# Altium schematic sheet ESenseFE-Power.SchDoc
size B
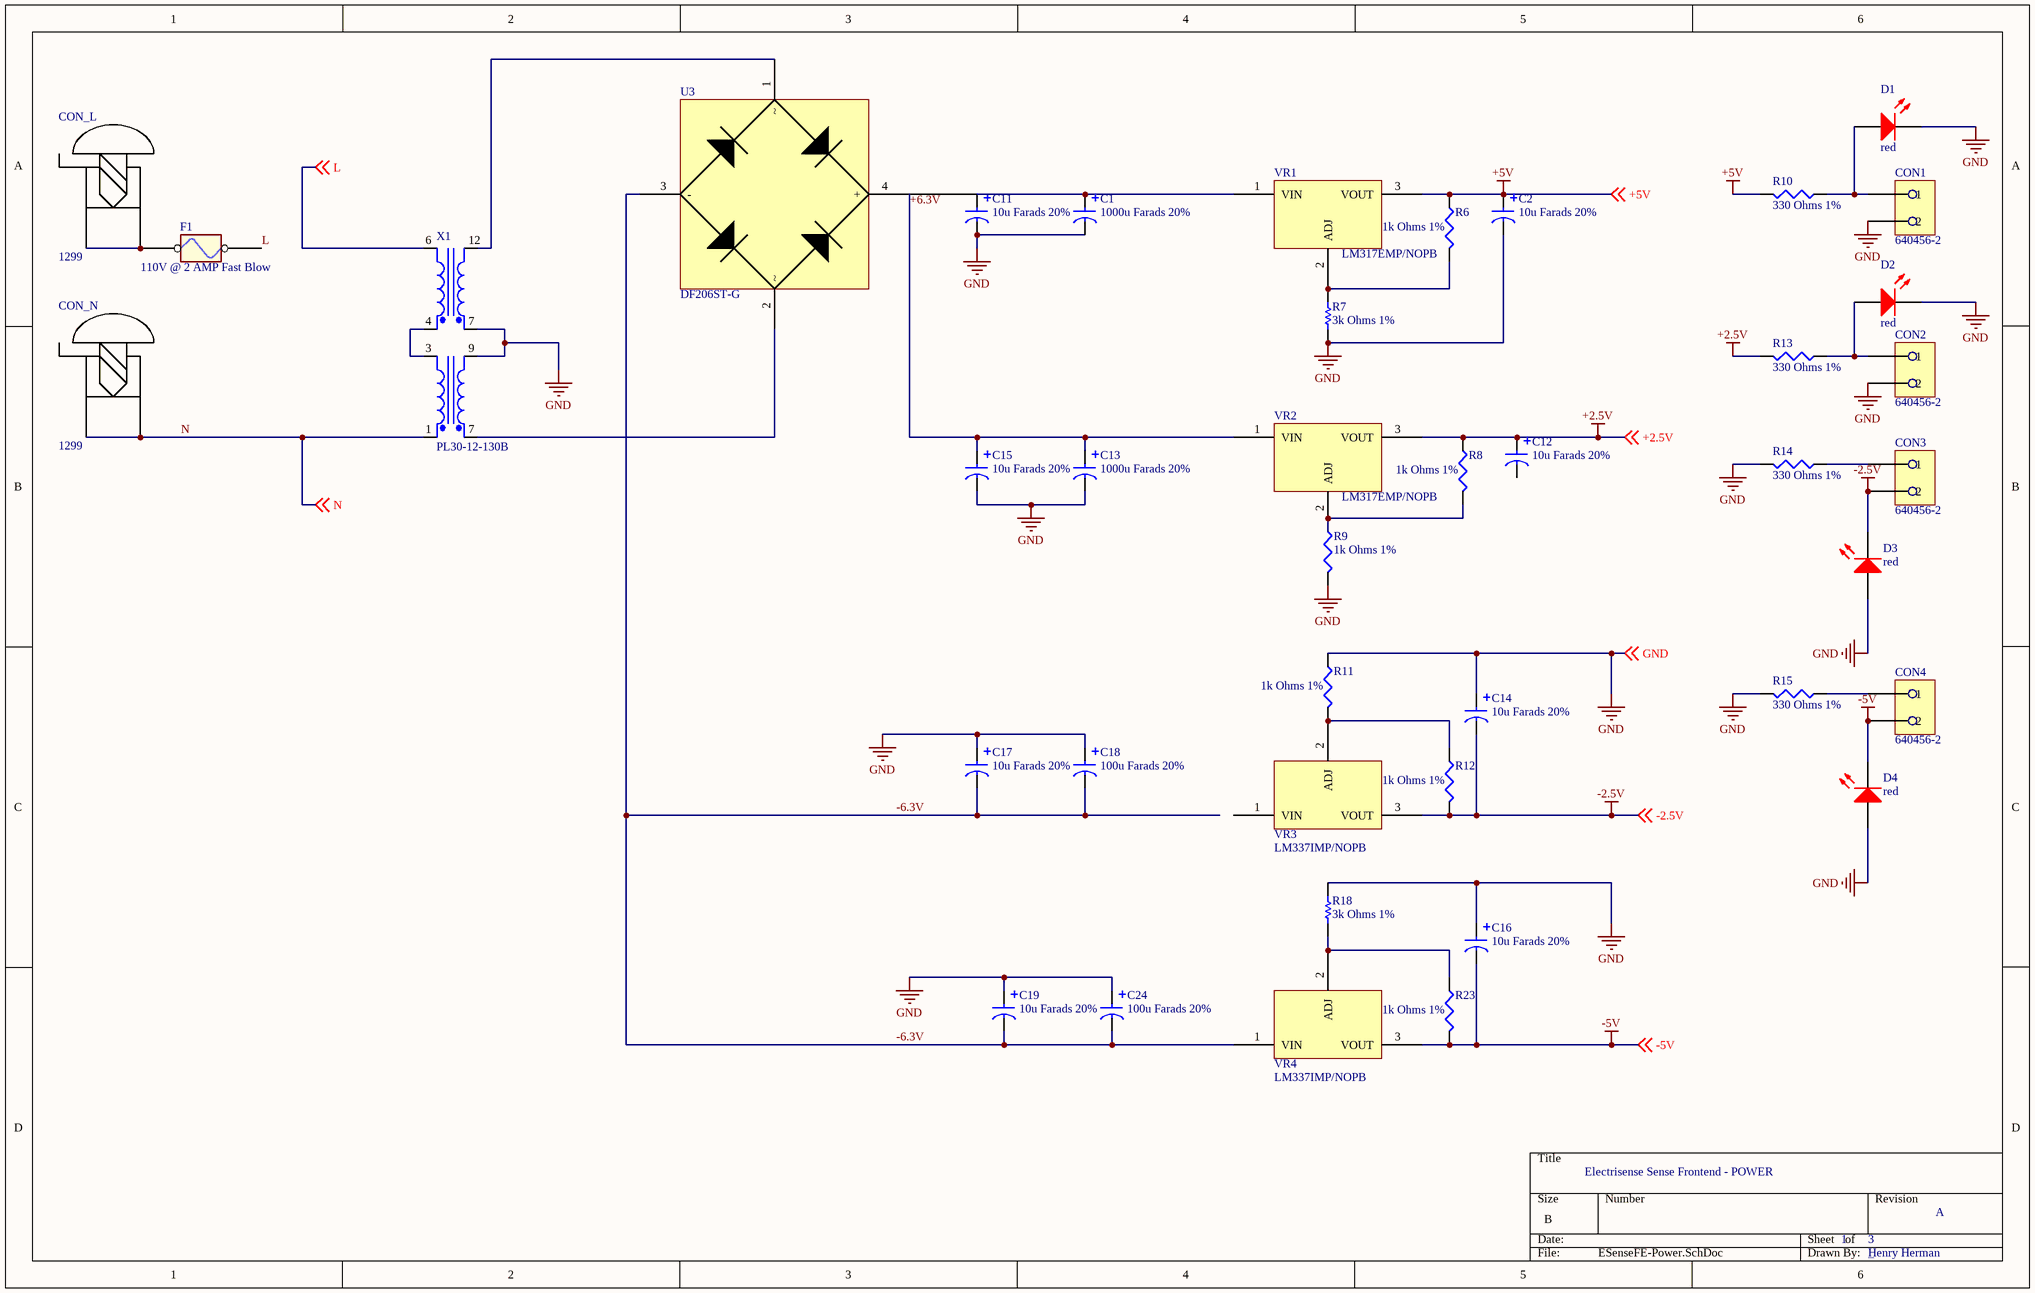
[diagram p0: ESenseFE-Power.SchDoc]

## Parts
C1  1000u Farads 20%  [CAP-CAN-SMD-POL-12.5mmDia]
C2  10u Farads 20%  [CAP-SMD-POL-5mmDia]
C11  10u Farads 20%  [CAP-SMD-POL-5mmDia]
C12  10u Farads 20%  [CAP-SMD-POL-5mmDia]
C13  1000u Farads 20%  [CAP-CAN-SMD-POL-12.5mmDia]
C14  10u Farads 20%  [CAP-SMD-POL-5mmDia]
C15  10u Farads 20%  [CAP-SMD-POL-5mmDia]
C16  10u Farads 20%  [CAP-SMD-POL-5mmDia]
C17  10u Farads 20%  [CAP-SMD-POL-5mmDia]
C18  100u Farads 20%  [CAP-SMD-POL-5mmDia]
C19  10u Farads 20%  [CAP-SMD-POL-5mmDia]
C24  100u Farads 20%  [CAP-SMD-POL-5mmDia]
CON1  640456-2  [M02-LockingHeader-100mil-pitch]
CON2  640456-2  [M02-LockingHeader-100mil-pitch]
CON3  640456-2  [M02-LockingHeader-100mil-pitch]
CON4  640456-2  [M02-LockingHeader-100mil-pitch]
CON_L  1299  [LOW-PROFILE-SCREWTERMINAL]
CON_N  1299  [LOW-PROFILE-SCREWTERMINAL]
D1  red  [LITEON/LED/0603]
D2  red  [LITEON/LED/0603]
D3  red  [LITEON/LED/0603]
D4  red  [LITEON/LED/0603]
F1  110V @ 2 AMP Fast Blow  [WICKMANN/WK0011-ND]
R6  1k Ohms 1%  [SM/C_0603]
R7  3k Ohms 1%  [SM/C_0603]
R8  1k Ohms 1%  [SM/C_0603]
R9  1k Ohms 1%  [SM/C_0603]
R10  330 Ohms 1%  [SM/C_0603]
R11  1k Ohms 1%  [SM/C_0603]
R12  1k Ohms 1%  [SM/C_0603]
R13  330 Ohms 1%  [SM/C_0603]
R14  330 Ohms 1%  [SM/C_0603]
R15  330 Ohms 1%  [SM/C_0603]
R18  3k Ohms 1%  [SM/C_0603]
R23  1k Ohms 1%  [SM/C_0603]
U3  DF206ST-G  [BridgeRectifier-DFS]
VR1  LM317EMP/NOPB  [LM317-SOT233-POS-ADJ-VOLT_REG]
VR2  LM317EMP/NOPB  [LM317-SOT233-POS-ADJ-VOLT_REG]
VR3  LM337IMP/NOPB  [LM337-ADJ-NEG-VOLT-REG]
VR4  LM337IMP/NOPB  [LM337-ADJ-NEG-VOLT-REG]
X1  PL30-12-130B  [TRANSFORMER-DUAL-PRIMARY]

## Nets
+2.5V: C12.1 R8.1 R13.2 VR2.3(VOUT) ; off-sheet +2.5V
+5V: C2.1 R6.1 R10.2 VR1.3(VOUT) ; off-sheet +5V
-2.5V: C14.2 CON3.2 D3.2(K) R12.2 VR3.3(VOUT) ; off-sheet -2.5V
-5V: C16.2 CON4.2 D4.2(K) R23.2 VR4.3(VOUT) ; off-sheet -5V
GND: C1.2 C2.2 C11.2 C13.2 C14.1 C15.2 C16.1 C17.1 C18.1 C19.1 C24.1 CON1.2 CON2.2 D1.2(K) D2.2(K) D3.1(A) D4.1(A) R7.1 R9.2 R11.1 R14.2 R15.2 R18.2 X1.7 X1.9 ; off-sheet GND
+6.3V: C13.1 C15.1 U3.4(+) VR2.1(VIN)
-6.3V: C17.2 C18.2 C19.2 C24.2 U3.3(-) VR4.1(VIN)
L: F1.2 X1.6(Pri-) ; off-sheet L
N: CON_N.1 X1.1(Pri+) ; off-sheet N
NetC1_1: C1.1 C11.1 VR1.1(VIN)
NetCON1_1: CON1.1 D1.1(A) R10.1
NetCON2_1: CON2.1 D2.1(A) R13.1
NetCON3_1: CON3.1 R14.1
NetCON4_1: CON4.1 R15.1
NetCON_L_1: CON_L.1 F1.1
NetR6_2: R6.2 R7.2 VR1.2(ADJ)
NetR8_2: R8.2 R9.1 VR2.2(ADJ)
NetR11_2: R11.2 R12.1 VR3.2(ADJ)
NetR18_1: R18.1 R23.1 VR4.2(ADJ)
NetU3_1: U3.1 X1.12(Sec-)
NetU3_2: U3.2 X1.7(Sec+)
NetX1_3: X1.3(Pri-) X1.4(Pri+)

Not connected (* = marked no-connect by the designer): C12 2; VR3 1(VIN)

## Notes on the sheet
- Electrisense Sense Frontend - POWER
- 1
- 3
- A
- _
- Henry Herman

## Library data of the parts
C1 C13 = 2198: cap aluminum 1000uf 25vdc 20% 12.5 x 13.5mm smd 1100ma 5000; mfrName: Panasonic; mfrPartNum: EEV-FK1E102Q; Label: 1uF; Extra_Description: CAP 1000UF 25V ELECT FK SMD / Mounting Type: ``Surface Mount`` / Lead-Free Status: ``Lead Free`` / Packaging: ``Cut Tape (CT)`` / RoHS: ``Compliant`` / Voltage Rating (DC): { / ``uncertainty_minus``: null, / ``value``: 25.0, / ``uncertainty_plus``: null / } / Size-Width: { / ``uncertainty_minus``: null, / ``value``: 0.0135, / ``uncertainty_plus``: null / } / Size-Length: { / ``uncertainty_minus``: null, / ``value``: 0.015, / ``uncertainty_plus``: null / } / Size-Height: { / ``uncertainty_minus``: null, / ``value``: 0.0135, / ``uncertainty_plus``: null / } / Size-Diameter: { / ``uncertainty_minus``: null, / ``value``: 0.0125, / ``uncertainty_plus``: null / } / Capacitance: { / ``uncertainty_minus``: null, / ``value``: 0.001, / ``uncertainty_plus``: null / } / Capacitance Tolerance: { / ``max_value``: 20.0, / ``max_uncertainty_plus``: null, / ``min_value``: -20.0, / ``min_uncertainty_plus``: null, / ``max_uncertainty_minus``: null / } / Operating Temperature: { / ``max_value``: 105.0, / ``max_uncertainty_plus``: null, / ``min_value``: null, / ``min_uncertainty_plus``: null, / ``max_uncertainty_minus``: null / }; Obsolete: False; Temp_Max: 0; Type: All Parts; TypeNotes: Applies to all parts in the database; PartID: 2198; URL_Image: http://cdn.sigma.octopart.com/8933382/image/Panasonic-EEV-FK1E102Q.jpg; URL_Datasheet: http://datasheet.octopart.com/EEV-FK1E102Q-Panasonic-datasheet-48.pdf; Date_Created: 5/7/2011 2:26:18 AM; Date_LastModified: 5/7/2011 2:26:18 AM; Verified: False; RoHS: True; Temp_Min: 0
C2 C11 C12 C14-C17 C19 = 2178: capacitor, case c, 10uf, 25v; application:general purpose;; mfrName: Panasonic; mfrPartNum: EEE1EA100SR; Label: 1uF; Extra_Description: CAPACITOR, CASE C, 10UF, 25V; Application:General Purpose; Capacitance:10µF; Tolerance, Capacitance:± 20%; Series:VS; Voltage, Rating:25V dc; Capacitor Dielectric Type:Aluminium Electrolytic; Case Style:C; External Length / Height:5.4mm; Body Diameter:5mm; Lead Spacing:1.5mm; Termination Type:SMD; Operating Temperature Range:-40°C to +85°C; AC Ripple Current:28mA; External Depth:5.3mm; Lead Length:2.2mm; Leakage Current:3µA; Operating Lifetime:2000h; Power Factor:0.14; Power Factor Frequency:120Hz; Ripple Current Frequency:120Hz; Temp, Op. Max:85°C; Temp, Op. Min:-40°C; Temperature, Operating Life:85°C; Temperature, Ripple Current:85°C; Tolerance, +:20%; Tolerance, -:20%; Voltage Rating, DC:25V; Width, External:5.3mm; Width, Lead Cross-section:0.65mm; Width, Tape:12mm / Mounting Type: ``Surface Mount`` / Lead-Free Status: ``Lead Free`` / Packaging: ``Cut Tape (CT)`` / Dielectric Material: ``Aluminum Electrolytic`` / RoHS: ``Compliant`` / Size-Height: { / ``uncertainty_minus``: null, / ``value``: 0.0054, / ``uncertainty_plus``: null / } / Voltage Rating (DC): { / ``uncertainty_minus``: null, / ``value``: 25.0, / ``uncertainty_plus``: null / } / Lead Length: { / ``uncertainty_minus``: null, / ``value``: 0.0022, / ``uncertainty_plus``: null / } / Size-Diameter: { / ``uncertainty_minus``: null, / ``value``: 0.005, / ``uncertainty_plus``: null / } / Capacitance: { / ``uncertainty_minus``: null, / ``value``: 1E-05, / ``uncertainty_plus``: null / } / Capacitance Tolerance: { / ``max_value``: 20.0, / ``max_uncertainty_plus``: null, / ``min_value``: -20.0, / ``min_uncertainty_plus``: null, / ``max_uncertainty_minus``: null / } / Operating Temperature: { / ``max_value``: 85.0, / ``max_uncertainty_plus``: null, / ``min_value``: null, / ``min_uncertainty_plus``: null, / ``max_uncertainty_minus``: null / } / Number of Pins: 2; Obsolete: False; Temp_Max: 0; Type: All Parts; TypeNotes: Applies to all parts in the database; PartID: 2178; URL_Image: http://cdn.sigma.octopart.com/8896371/image/Panasonic-EEE1EA100SR.jpg; URL_Datasheet: http://datasheet.octopart.com/EEE1EA100SR-Panasonic-datasheet-5314063.pdf; Date_Created: 5/5/2011 2:23:52 AM; Date_LastModified: 5/5/2011 2:23:52 AM; Verified: False; RoHS: True; Temp_Min: 0
C18 C24 = 2180: cap 100uf 25vdc 20% 6.3 x 7.7mm smd 143ma 2000 hr t/r; mfrName: Panasonic; mfrPartNum: EEE-1EA101XP; Label: 1uF; Extra_Description: CAP ELECT 100UF 25V VS SMD / Mounting Type: ``Surface Mount`` / Lead-Free Status: ``Lead Free`` / Packaging: ``Cut Tape (CT)`` / RoHS: ``Compliant`` / Size-Height: { / ``uncertainty_minus``: null, / ``value``: 0.008, / ``uncertainty_plus``: null / } / Voltage Rating (DC): { / ``uncertainty_minus``: null, / ``value``: 25.0, / ``uncertainty_plus``: null / } / Size-Diameter: { / ``uncertainty_minus``: null, / ``value``: 0.0063, / ``uncertainty_plus``: null / } / Capacitance: { / ``uncertainty_minus``: null, / ``value``: 0.0001, / ``uncertainty_plus``: null / } / Capacitance Tolerance: { / ``max_value``: 20.0, / ``max_uncertainty_plus``: null, / ``min_value``: -20.0, / ``min_uncertainty_plus``: null, / ``max_uncertainty_minus``: null / } / Operating Temperature: { / ``max_value``: 85.0, / ``max_uncertainty_plus``: null, / ``min_value``: null, / ``min_uncertainty_plus``: null, / ``max_uncertainty_minus``: null / }; Obsolete: False; Temp_Max: 0; Type: All Parts; TypeNotes: Applies to all parts in the database; PartID: 2180; URL_Image: http://cdn.sigma.octopart.com/9093796/image/Panasonic-EEE-1EA101XP.jpg; URL_Datasheet: http://datasheet.octopart.com/EEE-1EA101XP-Panasonic-datasheet-6019.pdf; Date_Created: 5/5/2011 3:27:05 AM; Date_LastModified: 5/5/2011 3:27:05 AM; Verified: False; RoHS: True; Temp_Min: 0
CON1-CON4 = 2184: header, vertical, 0.1``, 2way; connector type:wire-to-board;; mfrName: Tyco Electronics; Extra_Description: HEADER, VERTICAL, 0.1``, 2WAY; Connector Type:Wire-to-Board; Gender:Pin; Ways, No. of:2; Lead Spacing:2.54mm; Termination Method:Solder; Contact Material:Copper Alloy; Series:MTA; Contact Plating:Tin; No. of Rows:1; Current Rating:4A; No. of Poles:2; Pitch:0.1``; Voltage Rating, AC:250V; Voltage, Working:250V / Contact Plating: ``Tin`` / Gender: ``Male`` / Packaging: ``Bulk`` / RoHS: ``Compliant`` / Mounting Type: ``Through Hole`` / Lead-Free Status: ``Lead Free`` / Contact Material: ``Copper Alloy`` / Shrouded: ``No`` / Housing Color: ``White`` / Housing Material: ``Polyester`` / Current Rating: { / ``uncertainty_minus``: null, / ``value``: 4.0, / ``uncertainty_plus``: null / } / Pin Pitch: { / ``uncertainty_minus``: null, / ``value``: 0.00254, / ``uncertainty_plus``: null / } / Size-Width: { / ``uncertainty_minus``: null, / ``value``: 0.005715, / ``uncertainty_plus``: null / } / Size-Length: { / ``uncertainty_minus``: null, / ``value``: 0.00508, / ``uncertainty_plus``: null / } / Size-Height: { / ``uncertainty_minus``: null, / ``value``: 0.007874, / ``uncertainty_plus``: null / } / Mounting Angle: { / ``uncertainty_minus``: null, / ``value``: 180.0, / ``uncertainty_plus``: null / } / Voltage Rating (AC): { / ``uncertainty_minus``: null, / ``value``: 250.0, / ``uncertainty_plus``: null / } / Operating Temperature: { / ``max_value``: 105.0, / ``max_uncertainty_plus``: null, / ``min_value``: null, / ``min_uncertainty_plus``: null, / ``max_uncertainty_minus``: null / } / Number of Contacts: 2 / Number of Positions: 2 / Number of Rows: 1; Obsolete: False; Temp_Max: 0; TypeNotes: Applies to all parts in the database; PartID: 2184; mfrPartNum: 640456-2; URL_Image: http://cdn.sigma.octopart.com/9084900/image/Tyco-Electronics-640456-2.jpg; URL_Datasheet: http://datasheet.octopart.com/640456-2-Tyco-Electronics-datasheet-21919.pdf; Date_Created: 5/5/2011 5:31:56 AM; Date_LastModified: 5/5/2011 5:31:56 AM; Verified: False; RoHS: True; Temp_Min: 0; Type: All Parts
CON_L CON_N = 2177: brass tin plate low profile 10 - 32 thread with anti; mfrName: Keystone; Extra_Description: Brass Tin Plate Low Profile 10 - 32 Thread with Anti Rotation Tab Screw Terminal / Termination Style: ``Crimp`` / Material: ``Brass`` / Packaging: ``Bulk`` / Orientation: ``Straight`` / RoHS: ``Compliant`` / Lead-Free Status: ``Lead Free`` / Color: ``Black``; Obsolete: False; Temp_Max: 0; TypeNotes: Applies to all parts in the database; PartID: 2177; mfrPartNum: 1299; mfrWebsite: http://www.keyelco.com/; URL_Image: http://cdn.sigma.octopart.com/8947666/image/Keystone-1299.jpg; URL_Datasheet: http://datasheet.octopart.com/1299-Keystone-datasheet-23631.pdf; Date_Created: 5/5/2011 1:44:10 AM; Date_LastModified: 5/5/2011 1:44:10 AM; Verified: False; RoHS: True; Temp_Min: 0; Type: All Parts
D1-D4 = 2002: LED SUPER RED CLEAR 0603 SMD; mfrName: LITE-ON INC; mfrPartNum: LTST-C190KRKT; Extra_Description: Datasheets	LTST-C190KRKT / Product Photos	LTST-C190KGKT, LTST-C190KGKT, LTST-C190KSKT, LTST-C190KYKT / Catalog Drawings	LED 0603 Series / LED 0603 Series Side / Standard Package	1 / Category	Optoelectronics / Family	LEDs - <75mA, Discrete / Series	- / Color	Red / Luminous Flux @ Current - Test	196 mlm / Current - Test	20mA / Wavelength - Dominant	631nm / Wavelength - Peak	639nm / Millicandela Rating	54mcd / Voltage - Forward (Vf) Typ	2.0V / Lens Type	Clear / Lens Style/Size	Rectangle, 1.06mm x 0.8mm / Package / Case	0603 (1608 Metric) / Mounting Type	Surface Mount / Viewing Angle	130° / Packaging	Cut Tape (CT) / Size / Dimension	* / Height	* / Catalog Page	2744 (US2010 Interactive) / 2744 (US2010 PDF) / Other Names	160-1436-1; Obsolete: False; Temp_Max: 0; Type: UNKNOWN; Published: 8-Jun-2000; LatestRevisionDate: 17-Jul-2002; LatestRevisionNote: Re-released for DXP Platform.; PackageVersion: Feb-2002; PackageReference: 3.2X1.6X1.1; Publisher: Altium Limited; PartID: 2002; URL_Image: http://media.digikey.com/photos/Lite%20On%20Photos/LTST-C190KGKT,LTST-C190KRKT,LTST-C190KSKT,LTST-C190KYKT_sml.jpg; URL_Datasheet: http://optoelectronics.liteon.com/en-us/api/DwonloadFileHandler.ashx?txtSpecNo=DS-22-99-0151&txtPartNo=LTST-C190KRKT; Date_Created: 7/8/2010 11:36:30 PM; Date_LastModified: 7/8/2010 11:36:30 PM; Verified: False; RoHS: True; Temp_Min: 0
F1 = 1045: FUSEHOLDER OPEN 5X20MM PC MNT; mfrName: Wickmann USA, Inc.; mfrPartNum: 6490000100; Extra_Description: Wickmann USA, Inc. / TypeHolder / Fuse Size5mm x 20mm / MountingPCB / SpecificationsMiniature / MaterialThermoplastic, Black / Other Names19649 / 649 / WK0011; Type: Fuseholders; PartID: 1045; URL_Image: http://media.digikey.com/photos/Wickmann%20Photos/6490000100_sml.jpg; URL_Datasheet: http://www.digikey.com/scripts/DkSearch/dksus.dll?Pname?Name=WK0011-ND&Site=US; Date_Created: 8/1/2004 3:23:57 AM; Date_LastModified: 8/21/2009 1:12:53 AM; Verified: False
R6 R8 R9 R11 R12 R23 = 2043: RES 1.00K OHM 1/10W 1% 0603 SMD; mfrName: Panasonic - ECG; mfrPartNum: ERJ-3EKF1001V; Extra_Description: Datasheets	ERJ-3EKF1001V View All Specifications / Product Photos	0603 Pkg / Catalog Drawings	1% Thick Film Chip Material / 1% Thick Film Chip / Standard Package	200 / Category	Resistors / Family	Chip Resistor - Surface Mount / Series	ERJ / Resistance In Ohms	1.00K / Power (Watts)	0.1W, 1/10W / Composition	Thick Film / Features	- / Temperature Coefficient	±100ppm/°C / Tolerance	±1% / Case	0603 (1608 metric) / Size / Dimension	0.063`` L x 0.031`` W (1.60mm x 0.80mm) / Height	0.018`` (0.45mm) / Lead Style	Surface Mount (SMD - SMT) / Packaging	Cut Tape (CT) / Catalog Page	1954 (US2010 Interactive) / 1954 (US2010 PDF) / Kits	RSM3H-ND - KIT CHIP RES 96 VALUES 50EA 0603 / Other Names	ERJ-3EKF1001 / ERJ3EKF1001 / P1.00KHCT; Obsolete: False; Temp_Max: 0; PartID: 2043; URL_Image: http://media.digikey.com/photos/Panasonic%20Photos/10-0603%20Resistor.jpg?cshift_ck=null&client_id=5042; URL_Datasheet: http://industrial.panasonic.com/www-cgi/jvcr13pz.cgi?E+PZ+3+AOA0002+ERJ3EKF1001V+7+WW; Date_Created: 9/14/2010 11:34:31 AM; Date_LastModified: 9/14/2010 11:34:31 AM; Verified: False; RoHS: True; Temp_Min: 0; Type: Chip Resistor - Surface Mount
R7 R18 = 2182: resistor, thick film, 30kohm, 100mw, 1%; resistance:30kohm;; mfrName: Yageo; mfrPartNum: RC0603FR-0730KL; Value: 1K; Extra_Description: RESISTOR, THICK FILM, 30KOHM, 100mW, 1%; Resistance:30kohm; Resistance Tolerance:± 1%; Power Rating:100mW; Voltage Rating:50V; Series:RC0603; Temperature Coefficient:± 100ppm/°C; Resistor Element Material:Thick Film ;RoHS Compliant: Yes / Mounting Type: ``Surface Mount`` / Case / Package: ``0603`` / Packaging: ``Cut Tape (CT)`` / Lead-Free Status: ``Lead Free`` / RoHS: ``Compliant`` / Resistance: { / ``uncertainty_minus``: null, / ``value``: 30000.0, / ``uncertainty_plus``: null / } / Voltage Rating (DC): { / ``uncertainty_minus``: null, / ``value``: 50.0, / ``uncertainty_plus``: null / } / Size-Width: { / ``uncertainty_minus``: null, / ``value``: 0.0008, / ``uncertainty_plus``: null / } / Size-Length: { / ``uncertainty_minus``: null, / ``value``: 0.0016, / ``uncertainty_plus``: null / } / Size-Height: { / ``uncertainty_minus``: null, / ``value``: 0.00045, / ``uncertainty_plus``: null / } / Power Rating: { / ``uncertainty_minus``: null, / ``value``: 0.1, / ``uncertainty_plus``: null / } / Resistance Tolerance: { / ``max_value``: 1.0, / ``max_uncertainty_plus``: null, / ``min_value``: -1.0, / ``min_uncertainty_plus``: null, / ``max_uncertainty_minus``: null / } / Operating Temperature: { / ``max_value``: 155.0, / ``max_uncertainty_plus``: null, / ``min_value``: null, / ``min_uncertainty_plus``: null, / ``max_uncertainty_minus``: null / }; Obsolete: False; Temp_Max: 0; TypeNotes: Applies to all parts in the database; Published: 8-Jun-2000; LatestRevisionDate: 17-Jul-2002; LatestRevisionNote: Re-released for DXP Platform.; PackageReference: AXIAL-0.3; Publisher: Altium Limited; PartID: 2182; URL_Image: http://cdn.sigma.octopart.com/8619856/image/Yageo-RC0603FR-0730KL.jpg; URL_Datasheet: http://datasheet.octopart.com/RC0603FR-0730KL-Yageo-datasheet-118562.pdf; Date_Created: 5/5/2011 4:03:11 AM; Date_LastModified: 5/5/2011 4:03:11 AM; Verified: False; RoHS: True; Temp_Min: 0; Type: All Parts
R10 R13-R15 = 2070: RES 330 OHM 1/10W 1% 0603 SMD; mfrName: Panasonic - ECG; mfrPartNum: ERJ-3EKF3300V; Extra_Description: Datasheets	ERJ-3EKF3300V View All Specifications / Product Photos	0603 Pkg / Catalog Drawings	1% Thick Film Chip Material / 1% Thick Film Chip / Standard Package	200 / Category	Resistors / Family	Chip Resistor - Surface Mount / Series	ERJ / Resistance In Ohms	330 / Power (Watts)	0.1W, 1/10W / Composition	Thick Film / Features	- / Temperature Coefficient	±100ppm/°C / Tolerance	±1% / Case	0603 (1608 metric) / Size / Dimension	0.063`` L x 0.031`` W (1.60mm x 0.80mm) / Height	0.018`` (0.45mm) / Lead Style	Surface Mount (SMD - SMT) / Packaging	Cut Tape (CT) / Catalog Page	1954 (US2010 Interactive) / 1954 (US2010 PDF) / Other Names	P330HCT; Obsolete: False; Temp_Max: 0; PartID: 2070; URL_Image: HTTP://MEDIA.DIGIKEY.COM/PHOTOS/PANASONIC%20PHOTOS/10-0603%20RESISTOR.JPG; URL_Datasheet: http://industrial.panasonic.com/www-cgi/jvcr13pz.cgi?E+PZ+3+AOA0002+ERJ3EKF3300V+7+WW; Date_Created: 9/27/2010 6:42:19 PM; Date_LastModified: 9/27/2010 6:42:19 PM; Verified: False; RoHS: True; Temp_Min: 0; Type: Chip Resistor - Surface Mount
U3 = 2179: schottky diode; operating temperature range:0°c to +70°c;; mfrName: Comchip; Extra_Description: BRIDGE RECTIFIER 600V 2A DFS / 4 pin; Obsolete: False; Temp_Max: 0; TypeNotes: Applies to all parts in the database; PartID: 2179; mfrPartNum: DF206ST-G; URL_Image: http://media.digikey.com/Photos/Comchip%20Tech%20Photos/DF206ST-G_sml.jpg; URL_Datasheet: http://datasheet.octopart.com/UC3610DW-Texas-Instruments-datasheet-152804.pdf; Date_Created: 5/5/2011 3:08:22 AM; Date_LastModified: 5/5/2011 3:08:22 AM; Verified: False; RoHS: True; Temp_Min: 0; Type: All Parts
VR1 VR2 = 2181: v reg, linear, 37v, smd; voltage regulator type:adjustable; mfrName: National Semiconductor; Extra_Description: V REG, LINEAR, 37V, SMD; Voltage Regulator Type:Adjustable Positive; Voltage, Input Max:40V; Voltage, Output Max:37V; Max Output Current:1.5A; No. of Outputs:1; Voltage, Output Adjustable Max:37V; Voltage, Output Adjustable Min:1.2V; Voltage, Supply Min:3V; Voltage, Supply Max:40V; Termination Type:SMD; Case Style:SOT-223; No. of Pins:4; Operating Temperature Range:0°C to +125°C / Mounting Type: ``Surface Mount`` / Lead-Free Status: ``Contains Lead`` / Packaging: ``Cut Tape (CT)`` / RoHS: ``Compliant`` / Current Rating: { / ``uncertainty_minus``: null, / ``value``: 1.0, / ``uncertainty_plus``: null / } / Output Current: { / ``uncertainty_minus``: null, / ``value``: 1.0, / ``uncertainty_plus``: null / } / Operating Temperature: { / ``max_value``: 125.0, / ``max_uncertainty_plus``: null, / ``min_value``: null, / ``min_uncertainty_plus``: null, / ``max_uncertainty_minus``: null / } / Output Voltage: { / ``max_value``: null, / ``max_uncertainty_plus``: null, / ``min_value``: 1.2, / ``min_uncertainty_plus``: null, / ``max_uncertainty_minus``: null / } / Supply Voltage (DC): { / ``max_value``: 40.0, / ``max_uncertainty_plus``: null, / ``min_value``: null, / ``min_uncertainty_plus``: null, / ``max_uncertainty_minus``: null / } / Number of Outputs: 1 / Number of Pins: 4; Obsolete: False; Temp_Max: 0; TypeNotes: Applies to all parts in the database; PartID: 2181; mfrPartNum: LM317EMP/NOPB; URL_Image: http://cdn.sigma.octopart.com/9036263/image/National-Semiconductor-LM317EMP/NOPB.jpg; URL_Datasheet: http://datasheet.octopart.com/LM317EMP/NOPB-National-Semiconductor-datasheet-124580.pdf; Date_Created: 5/5/2011 3:47:18 AM; Date_LastModified: 5/5/2011 3:47:18 AM; Verified: False; RoHS: True; Temp_Min: 0; Type: All Parts
VR3 VR4 = 2183: linear voltage regulator ic; output voltage adjustable; mfrName: National Semiconductor; Extra_Description: Linear Voltage Regulator IC; Output Voltage Adjustable Range:-1.2V to -37V; Output Current:1A; No. of Outputs:1; No. of Pins:3; Operating Temperature Range:-40°C to +125°C; Leaded Process Compatible:Yes; Output Current Max:1.5A ;RoHS Compliant: Yes / Mounting Type: ``Surface Mount`` / Case / Package: ``SOT-223`` / Packaging: ``Cut Tape (CT)`` / Lead-Free Status: ``Lead Free`` / RoHS: ``Compliant`` / Output Current: { / ``uncertainty_minus``: null, / ``value``: 1.5, / ``uncertainty_plus``: null / } / Operating Temperature: { / ``max_value``: 150.0, / ``max_uncertainty_plus``: null, / ``min_value``: null, / ``min_uncertainty_plus``: null, / ``max_uncertainty_minus``: null / } / Number of Pins: 3; Obsolete: False; Temp_Max: 0; TypeNotes: Applies to all parts in the database; PartID: 2183; mfrPartNum: LM337IMP/NOPB; URL_Image: http://cdn.sigma.octopart.com/9036263/image/National-Semiconductor-LM337IMP/NOPB.jpg; URL_Datasheet: http://datasheet.octopart.com/LM337IMP/NOPB-National-Semiconductor-datasheet-10977.pdf; Date_Created: 5/5/2011 4:18:00 AM; Date_LastModified: 5/5/2011 4:18:00 AM; Verified: False; RoHS: True; Temp_Min: 0; Type: All Parts
X1 = 2197: transformers 12.6vct @ 2.40a 6.3v @ 4.80a; mfrName: Tamura; Extra_Description: TRANSF LO PRO DUAL 6.3VAC 4.8A / Mounting Type: ``Through Hole`` / Lead-Free Status: ``Lead Free`` / Packaging: ``Bulk`` / RoHS: ``Compliant`` / Power Rating: { / ``uncertainty_minus``: null, / ``value``: 30.0, / ``uncertainty_plus``: null / } / Size-Length: { / ``uncertainty_minus``: null, / ``value``: 0.066675, / ``uncertainty_plus``: null / } / Size-Height: { / ``uncertainty_minus``: null, / ``value``: 0.0397, / ``uncertainty_plus``: null / } / Weight: { / ``uncertainty_minus``: null, / ``value``: 521.631, / ``uncertainty_plus``: null / } / Size-Width: { / ``uncertainty_minus``: null, / ``value``: 0.055575, / ``uncertainty_plus``: null / } / Frequency: { / ``max_value``: 60.0, / ``max_uncertainty_plus``: null, / ``min_value``: null, / ``min_uncertainty_plus``: null, / ``max_uncertainty_minus``: null / } / Output Power: { / ``max_value``: 30.0, / ``max_uncertainty_plus``: null, / ``min_value``: null, / ``min_uncertainty_plus``: null, / ``max_uncertainty_minus``: null / }; Obsolete: False; Temp_Max: 0; TypeNotes: Applies to all parts in the database; PartID: 2197; mfrPartNum: PL30-12-130B; URL_Image: http://cdn.sigma.octopart.com/9086040/image/Tamura-PL30-12-130B.jpg; URL_Datasheet: http://datasheet.octopart.com/PL30-12-130B-Tamura-datasheet-32611.pdf; Date_Created: 5/7/2011 2:03:49 AM; Date_LastModified: 5/7/2011 2:03:49 AM; Verified: False; RoHS: True; Temp_Min: 0; Type: All Parts